# EAGLE design heart_necklace (EAGLE 8.5.0)
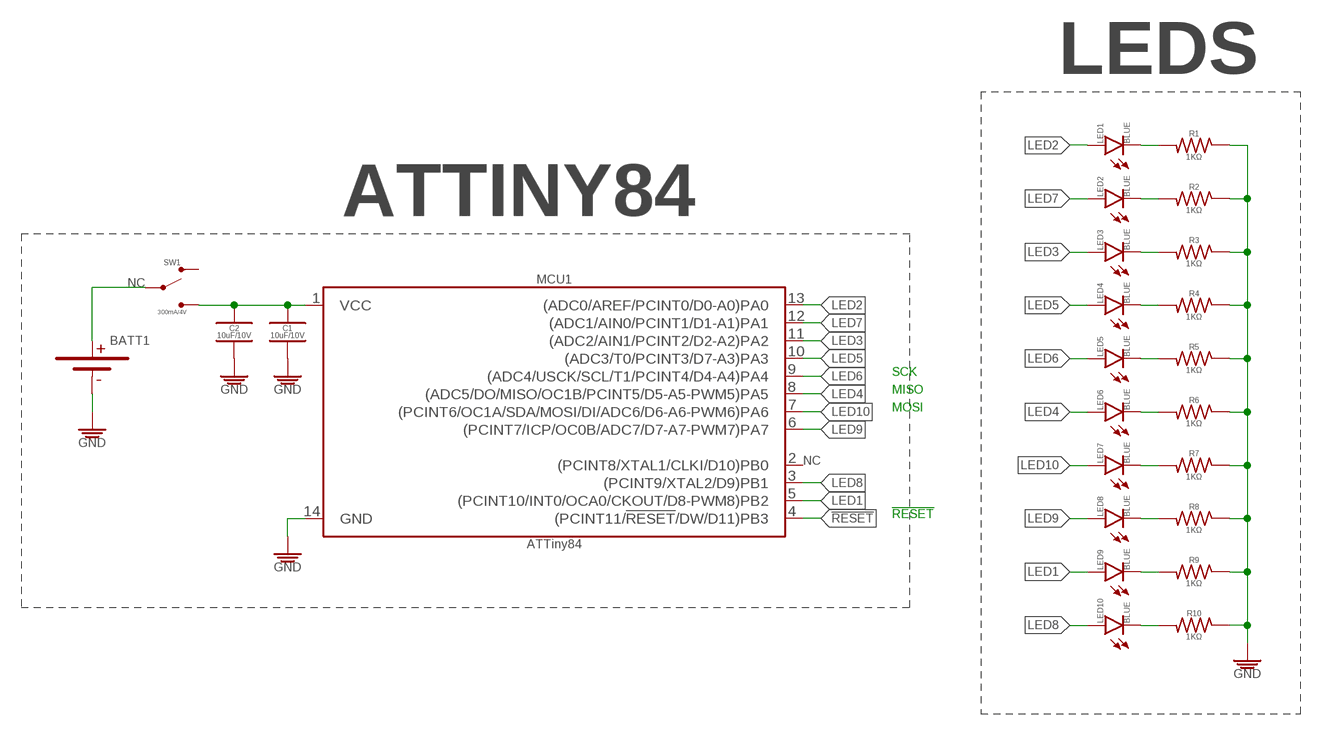
[diagram p0: schematic, sheet 1]

## Parts
BATT1  BATTERY_COIN-CELL_SMD_3V_20MM  [CR-2032]
C1  10uF/10V  10UF_CER_SMD-0402_10V-20%  [_CER_SMD_0402]
C2  10uF/10V  10UF_CER_SMD-0402_10V-20%  [_CER_SMD_0402]
LED1  BLUE  LED_SMD-0805_DISCRETE_NO-COLOR_NO-SILK  [LED_SMD-805_NO-SILK]
LED2  BLUE  LED_SMD-0805_DISCRETE_NO-COLOR_NO-SILK  [LED_SMD-805_NO-SILK]
LED3  BLUE  LED_SMD-0805_DISCRETE_NO-COLOR_NO-SILK  [LED_SMD-805_NO-SILK]
LED4  BLUE  LED_SMD-0805_DISCRETE_NO-COLOR_NO-SILK  [LED_SMD-805_NO-SILK]
LED5  BLUE  LED_SMD-0805_DISCRETE_NO-COLOR_NO-SILK  [LED_SMD-805_NO-SILK]
LED6  BLUE  LED_SMD-0805_DISCRETE_NO-COLOR_NO-SILK  [LED_SMD-805_NO-SILK]
LED7  BLUE  LED_SMD-0805_DISCRETE_NO-COLOR_NO-SILK  [LED_SMD-805_NO-SILK]
LED8  BLUE  LED_SMD-0805_DISCRETE_NO-COLOR_NO-SILK  [LED_SMD-805_NO-SILK]
LED9  BLUE  LED_SMD-0805_DISCRETE_NO-COLOR_NO-SILK  [LED_SMD-805_NO-SILK]
LED10  BLUE  LED_SMD-0805_DISCRETE_NO-COLOR_NO-SILK  [LED_SMD-805_NO-SILK]
MCU1  ATTiny84  ATTINY84_SO-14_NO-SILK  [SO-14_NO-SILK]
R1  1KΩ  1KΩ_SMD-0805_1/8W-5%  [RESISTOR_SMD-805]
R2  1KΩ  1KΩ_SMD-0805_1/8W-5%  [RESISTOR_SMD-805]
R3  1KΩ  1KΩ_SMD-0805_1/8W-5%  [RESISTOR_SMD-805]
R4  1KΩ  1KΩ_SMD-0805_1/8W-5%  [RESISTOR_SMD-805]
R5  1KΩ  1KΩ_SMD-0805_1/8W-5%  [RESISTOR_SMD-805]
R6  1KΩ  1KΩ_SMD-0805_1/8W-5%  [RESISTOR_SMD-805]
R7  1KΩ  1KΩ_SMD-0805_1/8W-5%  [RESISTOR_SMD-805]
R8  1KΩ  1KΩ_SMD-0805_1/8W-5%  [RESISTOR_SMD-805]
R9  1KΩ  1KΩ_SMD-0805_1/8W-5%  [RESISTOR_SMD-805]
R10  1KΩ  1KΩ_SMD-0805_1/8W-5%  [RESISTOR_SMD-805]
SW1  300mA/4V  SWITCH_SPDT_RA_SMD_300MA-4V_6.7L-2.6W  [SW_SLIDE_SPDT_RA_SMD_4V_300MA_6.7L-2.6W]

## Nets
!RESET: MCU1.4((PCINT11/!RESET!/DW/D11)PB3)
GND: BATT1.- C1.2 C2.2 MCU1.14(GND) R1.1 R2.1 R3.1 R4.1 R5.1 R6.1 R7.1 R8.1 R9.1 R10.1
LED1: LED9.A MCU1.5((PCINT10/INT0/OCA0/CKOUT/D8-PWM8)PB2)
LED2: LED1.A MCU1.13((ADC0/AREF/PCINT0/D0-A0)PA0)
LED3: LED3.A MCU1.11((ADC2/AIN1/PCINT2/D2-A2)PA2)
LED4: LED6.A MCU1.8((ADC5/DO/MISO/OC1B/PCINT5/D5-A5-PWM5)PA5)
LED5: LED4.A MCU1.10((ADC3/T0/PCINT3/D7-A3)PA3)
LED6: LED5.A MCU1.9((ADC4/USCK/SCL/T1/PCINT4/D4-A4)PA4)
LED7: LED2.A MCU1.12((ADC1/AIN0/PCINT1/D1-A1)PA1)
LED8: LED10.A MCU1.3((PCINT9/XTAL2/D9)PB1)
LED9: LED8.A MCU1.6((PCINT7/ICP/OC0B/ADC7/D7-A7-PWM7)PA7)
LED10: LED7.A MCU1.7((PCINT6/OC1A/SDA/MOSI/DI/ADC6/D6-A6-PWM6)PA6)
N$1: LED1.K R1.2
N$2: LED2.K R2.2
N$3: LED3.K R3.2
N$4: LED4.K R4.2
N$5: LED5.K R5.2
N$6: LED6.K R6.2
N$7: LED7.K R7.2
N$8: LED8.K R8.2
N$9: LED10.K R10.2
N$10: LED9.K R9.2
N$11: C1.1 C2.1 MCU1.1(VCC) SW1.3
N$17: MCU1.2((PCINT8/XTAL1/CLKI/D10)PB0)
VBATT: BATT1.+_1(+) BATT1.+_2(+) SW1.2
Unconnected: SW1.1

## Notes on the sheet
- LEDS
- ATTINY84
- NC
- SCK
- MISO
- MOSI
- NC
- !RESET

## Library data of the parts
BATT1 = PiB_batteries:BATTERY_COIN-CELL
C1 C2 = PiB_capacitors:10UF; CREATOR: MrSwirlyEyes; DATASHEET: http://www.samsungsem.com/kr/support/product-search/mlcc/__icsFiles/afieldfile/2017/07/28/S_CL05A106MP5NUNC.pdf; DIST: Digikey; DISTLINK: https://www.digikey.com/products/en?keywords=1276-1450-1-ND; DISTPN: 1276-1450-1-ND; MFR: Samsung Electro-Mechanics; MPN: CL05A106MP5NUNC
LED1-LED10 = PiB_leds:LED
MCU1 = PiB_ic_microcontrollers:ATTINY84; DATASHEET: http://ww1.microchip.com/downloads/en/DeviceDoc/doc8183.pdf; DIST: Digikey; DISTLINK: https://www.digikey.com/products/en?keywords=ATTINY84A-SSU-ND; DISTPN: ATTINY84A-SSU-ND; MFR: Microchip Technology; MPN: ATTINY84A-SSU
R1-R10 = PiB_resistors:1KΩ; CREATOR: Kenmei; DATASHEET: http://www.yageo.com/documents/recent/PYu-RC_Group_51_RoHS_L_7.pdf; DIST: Digikey; DISTLINK: https://www.digikey.com/product-detail/en/yageo/RC0805JR-071KL/311-1.0KARCT-ND/731165; DISTPN: 311-1.0KARCT-ND; MFR: Yageo; MPN: RC0805JR-071KL; TESTED: NO
SW1 = PiB_switches:SWITCH_SPDT; CREATOR: MrSwirlyEyes; DATASHEET: https://media.digikey.com/pdf/Data%20Sheets/APEM%20Components%20PDFs/MA_Series_.pdf; DIST: Digikey; DISTLINK: https://www.digikey.com/products/en?keywords=679-1847-1-ND; DISTPN: 679-1847-1-ND; MFR: APEM Inc.; MPN: MA12RTR; TESTED: YES

## Board
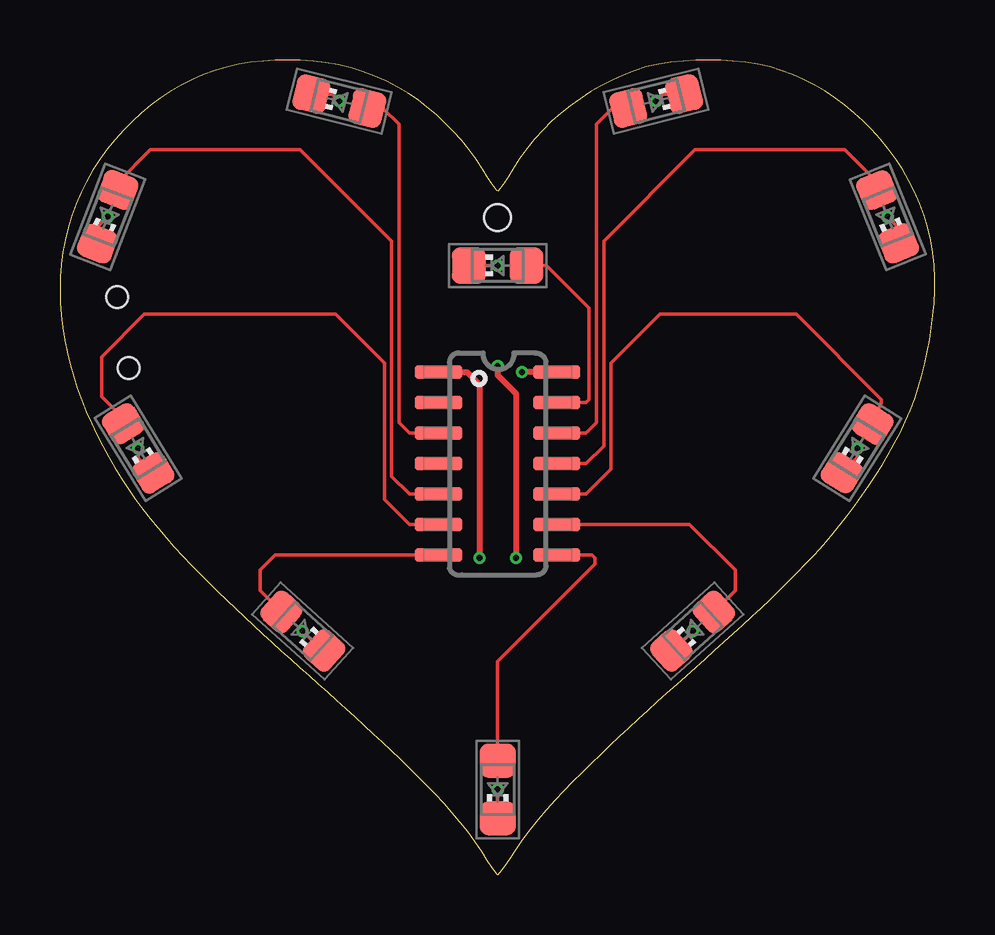
[diagram p1: board, top side]
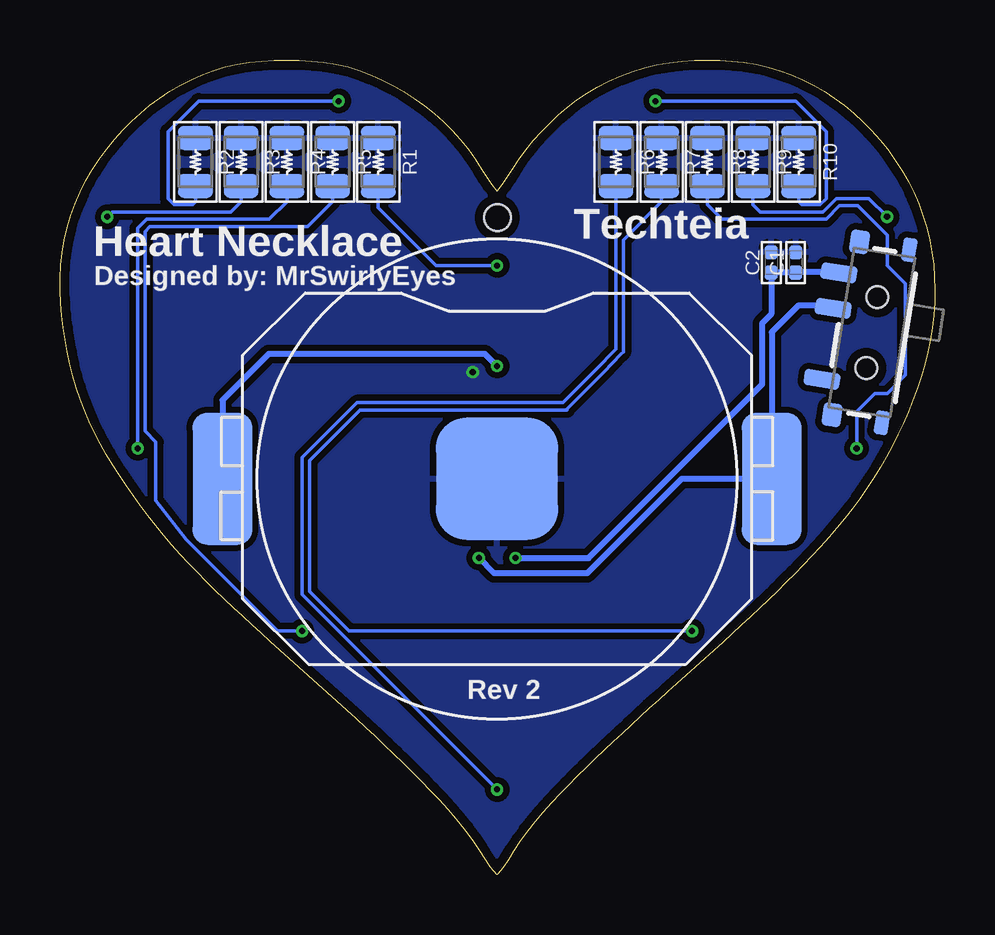
[diagram p2: board, bottom side, seen from below]

Size 36.47 x 33.98 mm. Coordinates in mm from the lower left corner, seen from the top.
Outline: 18.23,0.03 18.25,0 18.52,0.32 18.76,0.67 18.98,1.02 19.28,1.47 19.61,1.9 19.94,2.32 20.29,2.73 20.65,3.12 21.02,3.52 21.39,3.9 21.77,4.28 22.16,4.66 22.54,5.04 22.93,5.4 23.32,5.77 23.72,6.14 24.11,6.5 24.51,6.87 24.91,7.23 25.31,7.59 25.71,7.94 26.11,8.3 26.51,8.65 26.9,9 27.29,9.35 27.68,9.71 28.07,10.06 28.46,10.41 28.84,10.77 29.23,11.13 29.61,11.49 29.99,11.86 30.37,12.23 30.74,12.6 31.1,12.98 31.46,13.37 31.81,13.76 32.16,14.16 32.49,14.57 32.81,14.98 33.13,15.41 33.43,15.82 33.72,16.24 34,16.67 34.28,17.1 34.54,17.54 34.79,17.98 35.02,18.43 35.24,18.89 35.44,19.36 35.63,19.84 35.79,20.32 35.93,20.81 36.06,21.31 36.17,21.81 36.26,22.31 36.33,22.82 36.39,23.33 36.44,23.83 36.47,24.36 36.47,24.89 36.44,25.42 36.39,25.94 36.3,26.46 36.18,26.98 36.02,27.49 35.84,27.98 35.63,28.47 35.39,28.94 35.13,29.39 34.84,29.84 34.52,30.26 34.19,30.67 33.84,31.07 33.48,31.42 33.11,31.77 32.72,32.09 32.32,32.39 31.9,32.67 31.46,32.92 31.01,33.15 30.55,33.35 30.08,33.53 29.6,33.68 29.09,33.8 28.58,33.88 28.06,33.93 27.54,33.96 27.02,33.97 26.51,33.96 25.99,33.93 25.47,33.88 24.96,33.8 24.45,33.68 23.97,33.53 23.49,33.34 23.02,33.14 22.57,32.9 22.12,32.65 21.69,32.37 21.28,32.07 20.88,31.75 20.5,31.41 20.13,31.05 19.79,30.68 19.47,30.28 19.17,29.86 18.89,29.43 18.7,29.11 18.49,28.79 18.25,28.5 18.23,28.53
Outline: 18.23,28.53 18.02,28.79 17.81,29.11 17.61,29.43 17.34,29.85 17.05,30.25 16.73,30.63 16.4,31 16.05,31.35 15.69,31.69 15.31,32.01 14.92,32.31 14.51,32.59 14.08,32.84 13.61,33.08 13.12,33.3 12.62,33.49 12.11,33.65 11.6,33.78 11.07,33.87 10.54,33.93 10.01,33.97 9.48,33.98 8.97,33.96 8.46,33.93 7.95,33.87 7.45,33.79 6.95,33.68 6.46,33.53 5.98,33.36 5.5,33.16 5.05,32.93 4.61,32.68 4.18,32.39 3.77,32.08 3.38,31.76 3.01,31.41 2.65,31.05 2.3,30.66 1.97,30.25 1.66,29.82 1.38,29.38 1.11,28.93 0.88,28.46 0.67,27.98 0.49,27.49 0.34,26.98 0.22,26.47 0.12,25.96 0.05,25.44 0.01,24.92 0,24.39 0.01,23.87 0.05,23.35 0.11,22.82 0.19,22.31 0.3,21.79 0.42,21.29 0.57,20.78 0.73,20.28 0.91,19.79 1.1,19.3 1.32,18.82 1.54,18.35 1.78,17.89 2.02,17.43 2.28,16.98 2.55,16.54 2.83,16.11 3.13,15.68 3.44,15.27 3.76,14.86 4.09,14.46 4.42,14.07 4.77,13.68 5.12,13.3 5.48,12.92 5.84,12.55 6.2,12.19 6.57,11.82 6.94,11.46 7.32,11.11 7.7,10.75 8.08,10.4 8.46,10.04 8.84,9.7 9.22,9.35 9.61,9 10,8.65 10.38,8.31 10.77,7.97 11.15,7.62 11.53,7.28 11.91,6.93 12.29,6.59 12.67,6.24 13.05,5.89 13.43,5.54 13.8,5.19 14.18,4.83 14.54,4.47 14.91,4.11 15.27,3.74 15.63,3.37 15.98,3 16.33,2.62 16.66,2.22 16.98,1.82 17.29,1.41 17.57,0.98 17.78,0.64 18,0.3 18.23,0.03
Outline: 18.23,0.03 18.23,0.03
Copper layers (1*16): Top 0.035559375mm / dielectric 1.6mm / Bottom 0.035559375mm
Design rules "oshpark-2layer": minimum track width 6mil, minimum drill 10mil, track to track 6mil, track to pad 6mil, pad to pad 6mil, via to via 6mil, smd to smd 6mil, copper to edge 15mil, drill to drill 6mil, minimum pad ring 5mil, minimum via ring 5mil, stop-mask expansion 2.5mil, vias tented up to drill 0mil, thermal gap 10mil
Holes 1.1 mm at 18.24,27.4

### Footprints (pad centres in the part's own frame; a part is rotated, then mirrored left to right if it is on the bottom)
CR-2032 = smd 2.5 x 5.5: +_1 -11.45,0; +_2 11.45,0 | smd 5.1 x 5.1: - 0,0
_CER_SMD_0402 = smd 0.6 x 0.55: 1 -0.425,0; 2 0.425,0
LED_SMD-805_NO-SILK = smd 1.4 x 1.5: A -1.2,0; K 1.2,0
SO-14_NO-SILK = smd 1.981 x 0.559: 1 -2.464,3.81; 2 -2.464,2.54; 3 -2.464,1.27; 4 -2.464,0; 5 -2.464,-1.27; 6 -2.464,-2.54; 7 -2.464,-3.81; 8 2.464,-3.81; 9 2.464,-2.54; 10 2.464,-1.27; 11 2.464,0; 12 2.464,1.27; 13 2.464,2.54; 14 2.464,3.81
RESISTOR_SMD-805 = smd 1 x 1.45: 1 -1,0; 2 1,0
SW_SLIDE_SPDT_RA_SMD_4V_300MA_6.7L-2.6W = smd 1.5 x 0.7: 1 1.75,2.25; 2 1.75,-0.75; 3 1.75,-2.25 | smd 0.6 x 1: NC1 -1,-3.65; NC3 -1,3.65 | smd 0.8 x 1: NC2 1.1,-3.65; NC4 1.1,3.65 | hole 0.9: 0,-1.5; 0,1.5

### Placement (x,y rotation side)
BATT1  18.25,16.52 180 bottom
C1  5.8,25.53 90 bottom
C2  6.82,25.53 90 bottom
LED1  18.25,25.41 180 top
LED2  24.85,32.26 14 top
LED3  34.5,27.44 292 top
LED4  33.23,17.79 238 top
LED5  26.38,10.17 222 top
LED6  18.25,3.56 270 top
LED7  10.12,10.17 318 top
LED8  3.26,17.79 301.5 top
LED9  1.99,27.44 249 top
LED10  11.64,32.26 166 top
MCU1  18.25,17.15 0 top
R1  23.2,29.72 270 bottom
R2  30.82,29.72 270 bottom
R3  28.92,29.72 270 bottom
R4  27.01,29.72 270 bottom
R5  25.11,29.72 270 bottom
R6  13.29,29.72 270 bottom
R7  11.39,29.72 270 bottom
R8  9.48,29.72 270 bottom
R9  7.58,29.72 270 bottom
R10  5.67,29.72 270 bottom
SW1  2.63,22.61 171 bottom

### Tracks (layer width: path | path; a pad name or v marks a point on that pad's centre or on a via)
GND  (via drill 0.25)
  Top 0.254: MCU1.14 v19.26,20.96
  pour Bottom (isolate 0.254): 0.46,34.01 0.46,-0.03 36.02,-0.03 36.02,34.01
LED1
  Top 0.152: MCU1.5 14.56,15.88 13.83,16.62 13.83,26.42 10.02,30.23 3.77,30.23 2.42,28.88 LED9.A
LED2
  Top 0.152: MCU1.13 21.93,19.69 22.06,19.82 22.06,23.63 20.28,25.41 LED1.A
LED3
  Top 0.152: MCU1.11 21.93,17.15 22.67,17.89 22.67,26.42 26.48,30.23 32.73,30.23 34.05,28.9 LED3.A
LED4
  Top 0.152: LED6.A 18.25,8.9 22.31,12.96 22.31,13.21 22.18,13.34 MCU1.8
LED5
  Top 0.152: MCU1.10 21.93,15.88 22.97,16.92 22.97,21.34 25,23.37 30.69,23.37 34.25,19.82 34.25,19.69 LED4.A
LED6
  Top 0.152: MCU1.9 26.25,14.61 28.15,12.71 28.15,11.85 LED5.A
LED7
  Top 0.152: MCU1.12 21.93,18.42 22.36,18.85 22.36,31.3 23.04,31.97 LED2.A
LED8
  Top 0.152: MCU1.3 14.56,18.42 14.13,18.85 14.13,31.3 13.46,31.97 LED10.A
LED9
  Top 0.152: MCU1.6 14.56,14.61 13.52,15.65 13.52,21.34 11.49,23.37 3.52,23.37 1.74,21.6 1.74,19.95 2.63,19.05 LED8.A
LED10
  Top 0.152: MCU1.7 8.98,13.34 8.34,12.71 8.34,11.85 LED7.A
N$1  (via drill 0.25)
  Top 0.152: LED1.K v18.25,25.41
  Bottom 0.152: v18.25,25.41 20.79,25.41 23.2,27.82 R1.2
N$2  (via drill 0.25)
  Top 0.152: v24.85,32.26 25.14,32.55 LED2.K
  Bottom 0.152: R2.2 30.82,28.07 30.95,27.95 31.71,27.95 31.96,28.2 31.96,30.99 30.69,32.26 v24.85,32.26
N$3  (via drill 0.25)
  Top 0.152: LED3.K 34.95,26.99 v34.5,27.44
  Bottom 0.152: R3.2 28.92,28.07 29.35,27.64 34.3,27.64 v34.5,27.44
N$4  (via drill 0.25)
  Top 0.152: LED4.K 33.23,17.4 v33.23,17.79
  Bottom 0.152: R4.2 27.01,28.07 27.75,27.34 32.85,27.34 33.23,26.95 v33.23,17.79
N$5  (via drill 0.25)
  Top 0.152: LED5.K 25.57,9.36 v26.38,10.17
  Bottom 0.152: v26.38,10.17 27.39,10.17 31.2,13.98 32.47,15.6 32.47,18.04 32.93,18.5 32.93,26.83 32.73,27.03 26.15,27.03 25.11,28.07 R5.2
N$6  (via drill 0.25)
  Top 0.152: LED6.K v18.25,3.56
  Bottom 0.152: v18.25,3.56 26.38,11.69 26.38,17.4 24.09,19.69 | 24.09,19.69 | R6.2 13.29,21.92 14.14,21.05 15.5,19.69 24.09,19.69
N$7  (via drill 0.25)
  Top 0.152: LED7.K 10.92,9.36 v10.12,10.17
  Bottom 0.152: v10.12,10.17 24.42,10.17 26.07,11.82 26.07,17.28 23.96,19.39 15.33,19.39 15.33,19.43 13.84,20.92 13.8,20.96 13.08,21.71 12.99,21.8 12.99,21.92 12.99,26.47 11.39,28.07 R7.2 | R7.2
N$8  (via drill 0.25)
  Top 0.152: v3.26,17.79 3.26,17.39 LED8.K | LED8.K
  Bottom 0.152: v3.26,17.79 3.26,19.31 2.5,20.07 1.99,20.07 1.23,20.83 1.23,24.64 1.99,25.41 1.99,26.68 3.21,27.89 3.97,27.89 4.53,27.34 8.87,27.34 9.48,27.95 | R8.2 9.48,27.95 | 9.48,27.95
N$9  (via drill 0.25)
  Top 0.152: LED10.K 11.35,32.55 v11.64,32.26
  Bottom 0.152: v11.64,32.26 5.8,32.26 4.53,30.99 4.53,28.2 4.79,27.95 5.55,27.95 5.67,28.07 R10.2
N$10  (via drill 0.25)
  Top 0.152: LED9.K 1.56,27.01 v1.99,27.44
  Bottom 0.152: v1.99,27.44 2.75,28.2 4.1,28.2 4.66,27.64 7.27,27.64 7.58,27.95 | 7.58,27.95 | 7.58,27.95 R9.2
N$11  (via drill 0.25)
  Top 0.254: MCU1.1 16.98,20.96 17.49,20.45 v17.49,13.21
  Bottom 0.254: v17.49,13.21 14.44,13.21 7.2,20.45 7.2,22.99 6.82,23.37 C2.1 C1.1 5.76,25.15 4.05,25.15 SW1.3
VBATT  (via drill 0.25)
  Top 0.254: v19.01,13.21 19.01,20.07 18.25,20.83 v18.25,21.21
  Bottom 0.254: SW1.2 4.37,23.75 5.67,23.75 6.8,22.63 BATT1.+_1 10.56,16.52 14.5,12.58 18.37,12.58 v19.01,13.21 | v18.25,21.21 18.76,21.72 27.77,21.72 29.7,19.8 BATT1.+_2

### Text on the board
bPlace: Techteia | Heart Necklace | Designed by: MrSwirlyEyes | Rev 2